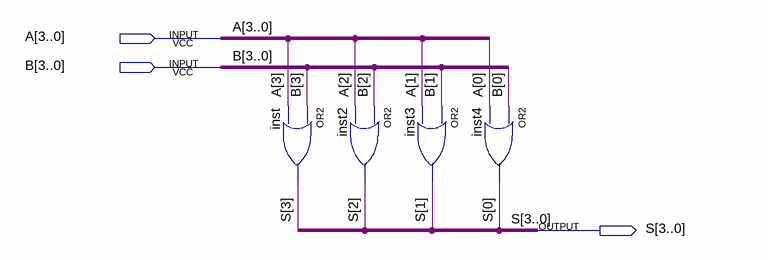
[diagram p0: schematic sheet]
// Quartus schematic or_4b.bdf as structural Verilog: 4 symbols, 3 pins
module or_4b (
  input  [3:0] A,
  input  [3:0] B,
  output [3:0] S
);

  or inst (S[3], B[3], A[3]);
  or inst2 (S[2], B[2], A[2]);
  or inst3 (S[1], B[1], A[1]);
  or inst4 (S[0], B[0], A[0]);
endmodule
